# EAGLE design PCB (EAGLE 8.2.1)
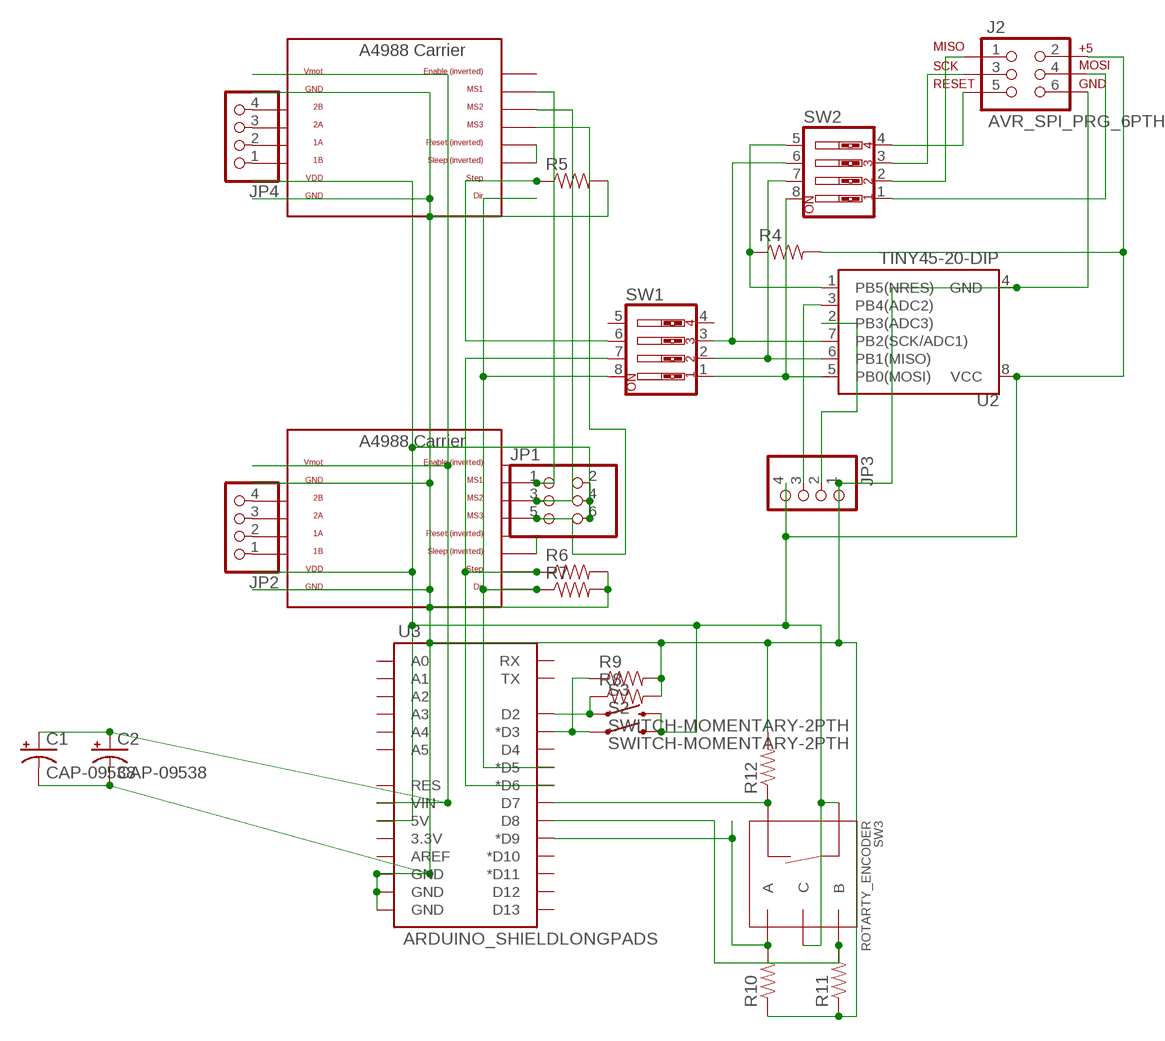
[diagram p0: schematic, sheet 1]

## Parts
C1  CAP-09538  1000UF-25V(PTH)  [CPOL-RADIAL-1000UF-25V]
C2  CAP-09538  1000UF-25V(PTH)  [CPOL-RADIAL-1000UF-25V]
J2  AVR_SPI_PRG_6PTH  [2X3]
JP1  PINHD-2X3  [2X03]
JP2  PINHD-1X4  [1X04]
JP3  PINHD-1X4  [1X04]
JP4  PINHD-1X4  [1X04]
R4  RESISTOR1206  [1206]
R5  RESISTOR1206  [1206]
R6  RESISTOR1206  [1206]
R7  RESISTOR1206  [1206]
R8  RESISTOR1206  [1206]
R9  RESISTOR1206  [1206]
R10  RESISTOR1206  [1206]
R11  RESISTOR1206  [1206]
R12  RESISTOR1206  [1206]
S2  SWITCH-MOMENTARY-2PTH  [TACTILE-PTH]
S3  SWITCH-MOMENTARY-2PTH  [TACTILE-PTH]
SW1  SW_DIP-4  [EDG-04]
SW2  SW_DIP-4  [EDG-04]
SW3  ROTARTY_ENCODER  [ROTARY_ENC_PLAIN]
U2  TINY45-20-DIP  ATTINY45TINY45-20-DIP  [DIP08]
U3  ARDUINO_SHIELDLONGPADS  [DUEMILANOVE_SHIELD_LONGPADS]
U$3  A4988BREAKOUT  [A4988BREAKOUT]
U$4  A4988BREAKOUT  [A4988BREAKOUT]

## Nets
N$19: JP1.1 U$3.MS1 U$4.MS1
N$20: JP1.3 U$3.MS2 U$4.MS2
N$21: JP1.5 U$3.MS3 U$4.MS3
N$22: JP2.1 U$3.1B
N$23: JP2.2 U$3.1A
N$24: JP2.3 U$3.2A
N$25: JP2.4 U$3.2B
N$26: R9.1 S2.1 U3.D3(*D3)
N$27: U$3.RST U$3.SLP(SLEEP)
N$28: R5.1 SW1.6 U$4.STEP
N$29: R6.1 SW1.7 U3.D6(*D6) U$3.STEP
N$30: R7.1 SW1.8 U3.D5(*D5) U$3.DIR U$4.DIR
N$31: R8.1 S3.1 U3.D2
N$32: JP3.3 U2.3(PB4(ADC2))
N$33: JP3.2 U2.2(PB3(ADC3))
N$34: JP4.1 U$4.1B
N$35: JP4.2 U$4.1A
N$36: JP4.3 U$4.2A
N$37: JP4.4 U$4.2B
N$38: R10.2 SW3.A U3.D9(*D9)
N$39: U$4.RST U$4.SLP(SLEEP)
N$41: C1.+ C2.+ U3.VIN U$3.VMOT U$4.VMOT
N$42: J2.2 JP1.2 JP1.4 JP1.6 JP3.4 R4.2 S2.3 S3.3 SW3.C SW3.SW+ U2.8(VCC) U3.5V U$3.VDD U$4.VDD
N$43: R11.2 SW3.B U3.D8
N$44: R12.1 SW3.SW- U3.D7
N$45: J2.4 SW2.1
N$46: J2.1 SW2.2
N$47: J2.3 SW2.3
N$48: J2.5 SW2.4
N$49: R4.1 SW2.5 U2.1(PB5(NRES))
N$50: SW1.3 SW2.6 U2.7(PB2(SCK/ADC1))
N$51: SW1.2 SW2.7 U2.6(PB1(MISO))
N$52: SW1.1 SW2.8 U2.5(PB0(MOSI))
N$54: C1.- C2.- J2.6 JP3.1 R5.2 R6.2 R7.2 R8.2 R9.2 R10.1 R11.1 R12.2 U2.4(GND) U3.GND@0(GND) U3.GND@1(GND) U3.GND@2(GND) U$3.GND U$3.GND@0(GND) U$4.GND U$4.GND@0(GND)
Unconnected: SW1.4 SW1.5 U3.3.3V U3.A0 U3.A1 U3.A2 U3.A3 U3.A4 U3.A5 U3.AREF U3.D4 U3.D10(*D10) U3.D11(*D11) U3.D12 U3.D13 U3.RES U3.RX U3.TX U$3.EN U$4.EN

## Library data of the parts
C1 C2 = SparkFun-Capacitors:1000UF-25V(PTH): CAP-08070; PROD_ID: CAP-09538
J2 = SparkFun-Connectors:AVR_SPI_PRG_6: AVR ISP 6 Pin This is the reduced ISP connector for AVR programming. Common on Arduino. This footprint will take up less PCB space and can be used with a 10-pin to 6-pin adapter such as SKU: BOB-08508 **Special note about "TEST_POINT" package. The stop mask is on the top side, so if you want your programming test points to be on the bottom of your board, make sure to place this package on the bottom side of the board. This also ensure that the orientation to program from the bottom side will be correct.
JP1 = pinhead:PINHD-2X3: PIN HEADER
JP2-JP4 = pinhead:PINHD-1X4: PIN HEADER
R4-R12 = SparkFun-Resistors:RESISTOR: Resistor Basic schematic elements and footprints for 0603, 1206, and PTH resistors.
S2 S3 = SparkFun-Electromechanical:SWITCH-MOMENTARY-2: Various NO switches- pushbuttons, reed, etc; PROD_ID: SWCH-08441
SW1 SW2 = special:SW_DIP-4: DIP SWITCH
SW3 = SparkFun-Electromechanical:ROTARTY_ENCODER: Simple no LED rotary encoder Example: COM-09117
U2 = SparkFun-DigitalIC:ATTINY45: Atmel 8-pin 2/4/8kB flash uC; PROD_ID: IC-09439
U3 = SparkFun-Boards:ARDUINO_SHIELD: Arduino shield footprint
U$3 U$4 = RepRapjr:A4988BREAKOUT

## Board
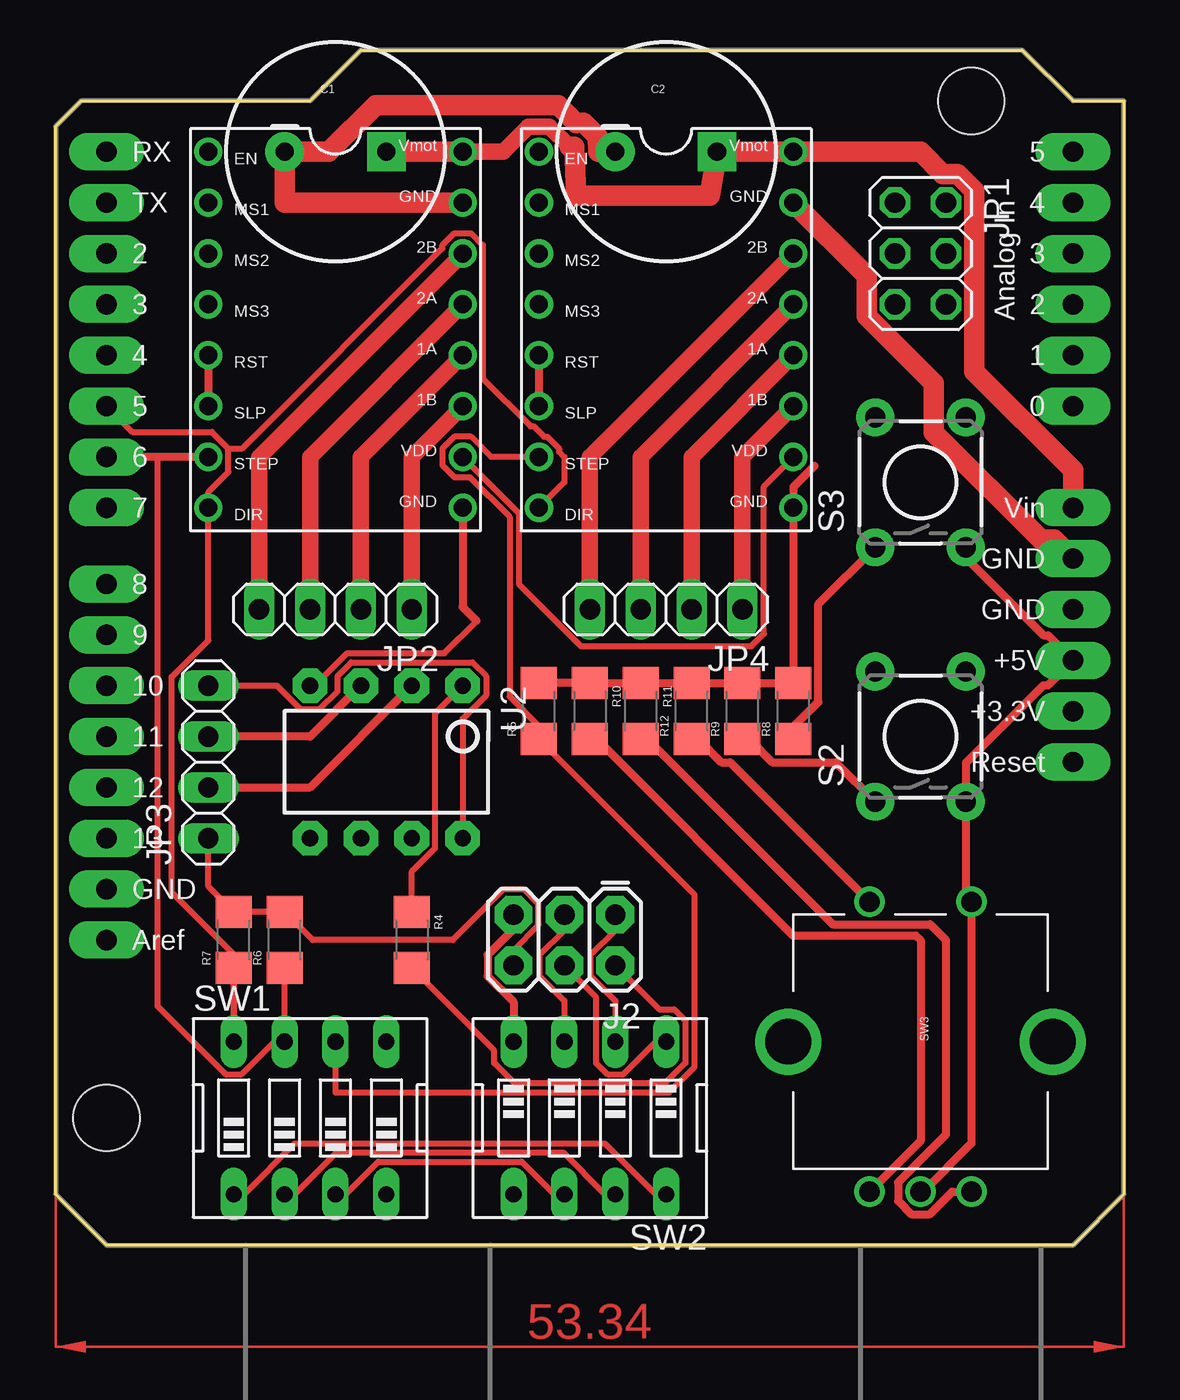
[diagram p1: board, top side]
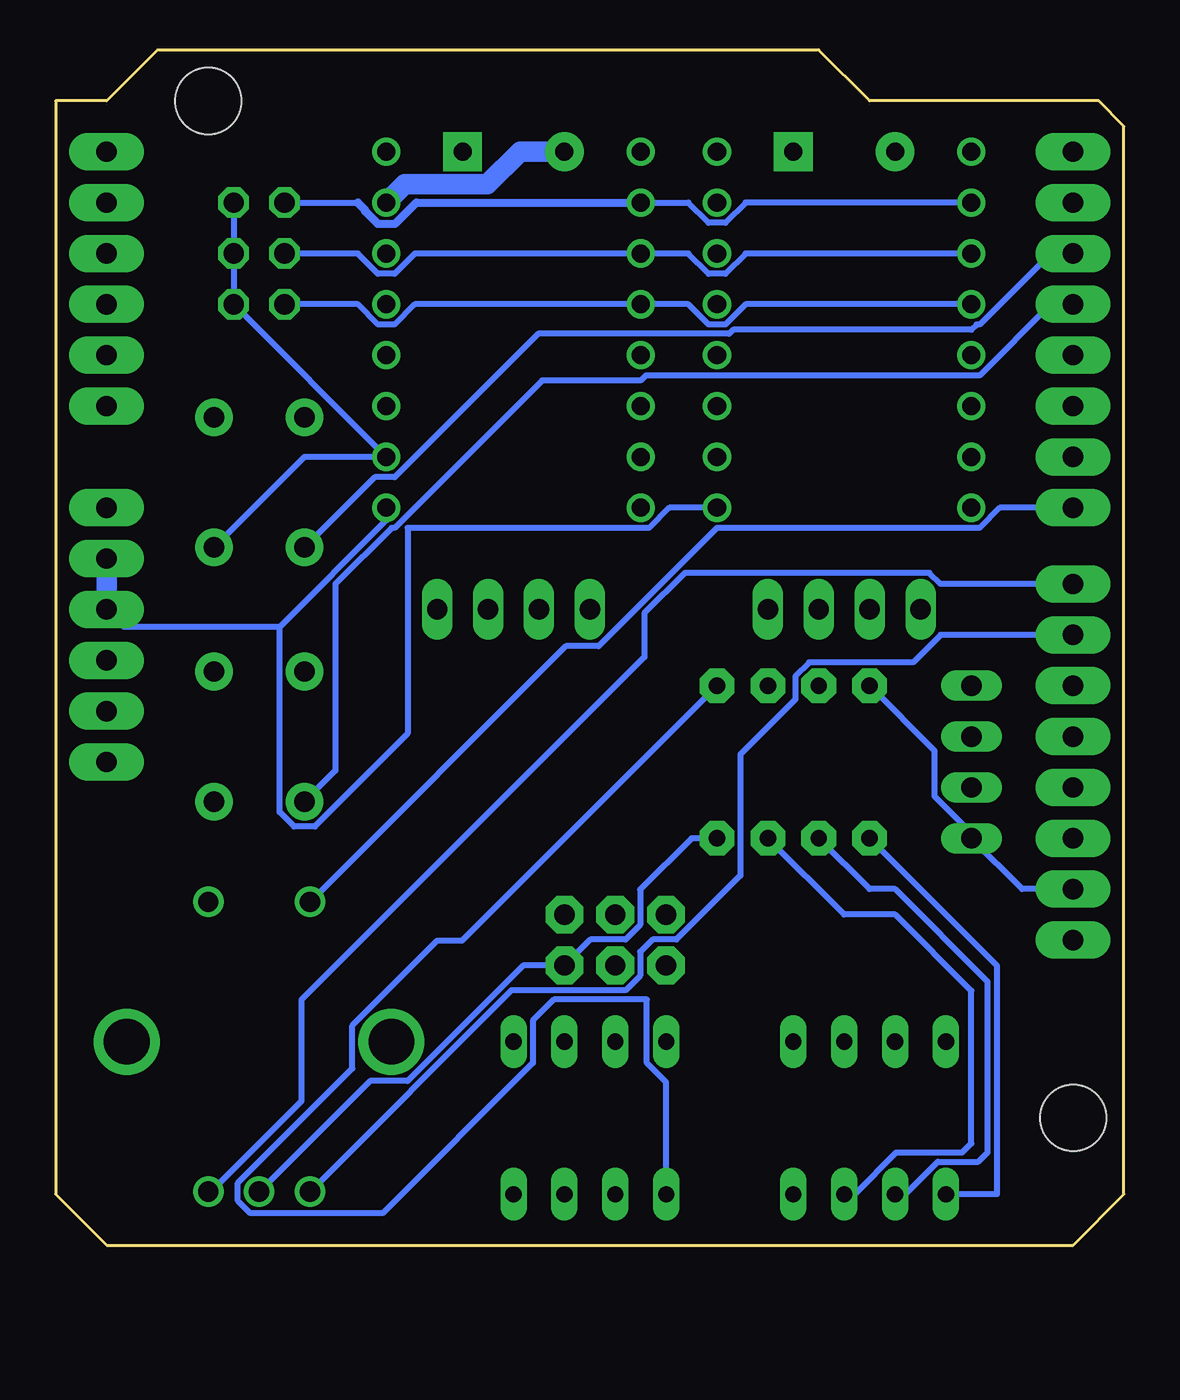
[diagram p2: board, bottom side, seen from below]

Size 53.34 x 59.69 mm. Coordinates in mm from the lower left corner, seen from the top.
Outline: 2.54,0 0,2.54 0,55.88 1.27,57.15 12.7,57.15 15.24,59.69 48.26,59.69 50.8,57.15 53.34,57.15 53.34,2.54 50.8,0 2.54,0
Copper layers (1*16): Top 0.035mm / dielectric 1.5mm / Bottom 0.035mm
Design rules "default": minimum track width 6mil, minimum drill 0.35mm, track to track 6mil, track to pad 6mil, pad to pad 6mil, via to via 6mil, smd to smd 6mil, copper to edge 40mil, drill to drill 6mil, minimum pad ring 10mil, minimum via ring 8mil, stop-mask expansion 4mil, vias tented up to drill 0mil, thermal gap 10mil

### Footprints (pad centres in the part's own frame; a part is rotated, then mirrored left to right if it is on the bottom)
CPOL-RADIAL-1000UF-25V = drill 0.9 pad 1.93 square: + 2.54,0 | drill 0.9 pad 1.93: - -2.54,0
2X3 = drill 1.016 pad 1.88 octagon: 1 0,0; 2 0,2.54; 3 2.54,0; 4 2.54,2.54; 5 5.08,0; 6 5.08,2.54
2X03 = drill 1.016 octagon: 1 -2.54,-1.27; 2 -2.54,1.27; 3 0,-1.27; 4 0,1.27; 5 2.54,-1.27; 6 2.54,1.27
1X04 = drill 1.016 long: 1 -3.81,0; 2 -1.27,0; 3 1.27,0; 4 3.81,0
1206 = smd 1.6 x 1.8: 1 -1.4,0; 2 1.4,0
TACTILE-PTH = drill 1.016 pad 1.88: 1 -3.251,2.261; 2 3.251,2.261; 3 -3.251,-2.261; 4 3.251,-2.261
EDG-04 = drill 0.813 long: 1 -3.81,-3.81; 2 -1.27,-3.81; 3 1.27,-3.81; 4 3.81,-3.81; 5 3.81,3.81; 6 1.27,3.81; 7 -1.27,3.81; 8 -3.81,3.81
ROTARY_ENC_PLAIN = drill 1.016: A 7.493,-2.54; B 7.493,2.54; C 7.493,0; SW+ -6.985,2.54; SW- -6.985,-2.54 | drill 2.286: P$3 0,6.604; P$4 0,-6.604
DIP08 = drill 0.813 pad 1.727 octagon: 1 -3.81,-3.81; 2 -1.27,-3.81; 3 1.27,-3.81; 4 3.81,-3.81; 5 3.81,3.81; 6 1.27,3.81; 7 -1.27,3.81; 8 -3.81,3.81
DUEMILANOVE_SHIELD_LONGPADS = drill 1.016 pad 1.88 long: 3.3V 50.8,26.67; 5V 50.8,29.21; A0 50.8,41.91; A1 50.8,44.45; A2 50.8,46.99; A3 50.8,49.53; A4 50.8,52.07; A5 50.8,54.61; AREF 2.54,15.24; D2 2.54,49.53; D3 2.54,46.99; D4 2.54,44.45; D5 2.54,41.91; D6 2.54,39.37; D7 2.54,36.83; D8 2.54,33.02; D9 2.54,30.48; D10 2.54,27.94; D11 2.54,25.4; D12 2.54,22.86; D13 2.54,20.32; GND@0 50.8,31.75; GND@1 50.8,34.29; GND@2 2.54,17.78; RES 50.8,24.13; RX 2.54,54.61; TX 2.54,52.07; VIN 50.8,36.83 | hole 3.302: 45.72,57.15; 2.54,6.35
A4988BREAKOUT = drill 0.9: 1A 8.89,1.27; 1B 11.43,1.27; 2A 6.35,1.27; 2B 3.81,1.27; DIR 16.51,-11.43; EN -1.27,-11.43; GND 16.51,1.27; GND@0 1.27,1.27; MS1 1.27,-11.43; MS2 3.81,-11.43; MS3 6.35,-11.43; RST 8.89,-11.43; SLP 11.43,-11.43; STEP 13.97,-11.43; VDD 13.97,1.27; VMOT -1.27,1.27

### Placement (x,y rotation side)
C1  13.97,54.61 0 top
C2  30.48,54.61 0 top
J2  27.94,16.51 180 top
JP1  43.18,49.53 270 top
JP2  13.97,31.75 180 top
JP3  7.62,24.13 90 top
JP4  30.48,31.75 180 top
R4  17.78,15.24 270 top
R5  24.13,26.67 90 top
R6  11.43,15.24 90 top
R7  8.89,15.24 90 top
R8  36.83,26.67 90 top
R9  34.29,26.67 90 top
R10  26.67,26.67 270 top
R11  29.21,26.67 270 top
R12  31.75,26.67 90 top
S2  43.18,25.4 90 top
S3  43.18,38.1 90 top
SW1  12.7,6.35 0 top
SW2  26.67,6.35 180 top
SW3  43.18,10.16 270 top
U2  16.51,24.13 180 top
U3  0,0 0 top
U$3  19.05,53.34 270 top
U$4  35.56,53.34 270 top

### Tracks (layer width: path | path; a pad name or v marks a point on that pad's centre or on a via)
N$19
  Bottom 0.305: U$3.MS1 18.89,52.07 19.9,51.06 20.74,51.06 21.75,52.07 U$4.MS1 | JP1.1 38.26,52.07
  Bottom 0.406: 38.26,52.07 37.89,51.7 37.89,51.63 37.27,51.01 36.39,51.01 35.33,52.07 U$4.MS1
N$20
  Bottom 0.305: U$3.MS2 18.89,49.53 19.9,48.52 20.74,48.52 21.75,49.53 U$4.MS2 35.4,49.53 36.41,48.52 37.25,48.52 38.26,49.53 JP1.3
N$21
  Bottom 0.305: U$3.MS3 18.89,46.99 19.9,45.98 20.74,45.98 21.75,46.99 U$4.MS3 35.4,46.99 36.41,45.98 37.25,45.98 38.26,46.99 JP1.5
N$22
  Top 0.813: JP2.1 17.78,39.37 U$3.1B
N$23
  Top 0.813: U$3.1A 15.24,39.37 JP2.2
N$24
  Top 0.813: U$3.2A 12.7,39.37 JP2.3
N$25
  Top 0.813: U$3.2B 10.16,39.37 JP2.4
N$26
  Top 0.406: R9.1 34.63,25.27 35.78,24.11 38.95,24.11 S2.1
  Bottom 0.305: U3.D3 3.65,46.99 7.2,43.44 23.87,43.44 24.13,43.18 29.05,43.18 36.41,35.82 36.57,35.82 39.37,33.02 39.37,23.7 S2.1
N$27
  Top 0.406: U$3.RST U$3.SLP
N$28
  Top 0.305: SW1.6 13.97,7.62 30.61,7.62 31.9,8.91 31.9,17.5 R5.1 | 24.13,25.4 R5.1 | 24.13,25.4 R5.1 | 24.13,25.4 24.13,25.94 22.66,27.41 22.66,36.38 20.68,38.36 19.9,38.36 19.31,38.95 19.31,39.79 19.9,40.38 20.74,40.38 21.75,39.37 U$4.STEP
N$29
  Top 0.305: R6.1 SW1.7 10.91,10.16 9.29,8.53 8.49,8.53 5.08,11.95 5.08,39.37
  Top 0.406: U$3.STEP 5.08,39.37 U3.D6
N$30
  Top 0.305: U3.D5 3.83,40.62 7.8,40.62 8.63,39.79 | 8.63,39.79 8.63,38.62 7.62,37.61 U$3.DIR 7.62,30.21 5.79,28.38 5.79,17.61 8.89,14.51 SW1.8 R7.1 8.89,13.97 | 8.63,39.79 9.31,39.79 19.31,49.79 19.31,49.95 19.9,50.54 20.74,50.54 21.33,49.95 21.33,43.28 23.71,40.9 23.87,40.9 24.39,40.38 24.55,40.38 25.14,39.79 25.14,39.63 25.4,39.37 25.4,38.1 U$4.DIR
N$31
  Top 0.406: R8.1 36.83,25.87 38.09,27.12 38.09,32.02 S3.1
  Bottom 0.305: U3.D2 3.65,49.53 7.2,45.98 7.36,45.98 7.62,45.72 19.52,45.72 19.71,45.52 29.25,45.52 36.41,38.36 37.41,38.36 S3.1
N$32
  Top 0.406: U2.3 12.7,25.4 JP3.3
N$33
  Top 0.406: JP3.2 12.7,22.86 U2.2
N$34
  Top 0.813: U$4.1B 34.29,39.37 JP4.1
N$35
  Top 0.813: JP4.2 31.75,39.37 U$4.1A
N$36
  Top 0.813: U$4.2A 29.21,39.37 JP4.3
N$37
  Top 0.813: JP4.4 26.67,39.37 U$4.2B
N$38
  Top 0.406: R10.2 27.01,25.27 36.81,15.47 42.95,15.47 43.18,15.24 43.18,5.21 SW3.A
  Bottom 0.305: U3.D9 9.16,30.48 10.53,29.11 15.72,29.11 16.41,28.42 16.41,27.26 19.15,24.52 19.15,18.46 22.34,15.27 23.54,15.27 24.16,14.65 24.16,13.45 24.88,12.72 30.58,12.72 SW3.A
N$39
  Top 0.406: U$4.RST U$4.SLP
N$41
  Top 0.813: U$3.VMOT 22.34,54.61 23.61,55.87 24.65,55.87 25.66,54.87 25.92,54.61
  Top 1.016: U3.VIN 50.8,38.71 45.87,43.63 45.87,52.66 45.04,53.49 44.3,53.49 43.18,54.61 U$4.VMOT C2.+ 32.66,52.43 26,52.43 25.9,54.87 25.66,54.87 | C1.+ U$3.VMOT
N$42
  Top 0.305: J2.2 30.12,11.79 30.88,11.79 31.45,11.22 31.45,9.1 30.42,8.08 22.92,8.08 21.89,9.1 21.89,9.72 R4.2 | JP3.4 11.05,27.94 12.22,26.77 13.18,26.77 14.07,27.66 14.07,28.42 14.76,29.11 20.8,29.11 21.49,28.42 21.49,27.46 20.32,26.29 U2.8 | U$3.VDD 23.12,36.57 23.12,33.03 26.23,29.92 34.73,29.92 35.36,30.55 35.36,37.9 U$4.VDD
  Top 0.406: S3.3 45.44,34.34 49.32,30.45 49.55,30.45 U3.5V 49.55,27.96 49.32,27.96 45.44,24.08 S2.3 45.44,17.42 SW3.SW+ 45.72,5.08 43.18,2.54 SW3.C
  Bottom 0.305: JP1.2 JP1.4 JP1.6 U$4.VDD 40.92,39.37 S3.3 | U2.8 21.59,20.32 24.16,17.75 24.16,15.99 24.88,15.27 26.64,15.27 J2.2 30,13.97 35.77,8.2 37.64,8.2 SW3.C
N$43
  Top 0.406: R11.2 29.55,25.27 38.79,16.03 43.66,16.03 44.45,15.24 44.45,5.52 42.06,3.13 42.06,2.2 42.72,1.55 43.64,1.55 44.76,2.67 SW3.B
  Bottom 0.305: U3.D8 9.16,33.02 9.72,33.58 21.92,33.58 23.94,31.56 23.94,29.37 41.07,12.24 41.07,7.19 45.72,2.54 SW3.B
N$44
  Top 0.406: SW3.SW- 33.67,24.11 33.24,24.11 32.09,25.27 R12.1
  Bottom 0.305: U3.D7 6.19,36.83 7.2,35.82 20.33,35.82 26.23,29.92 27.86,29.92 SW3.SW-
N$45
  Top 0.305: J2.4 26.98,12.39 26.98,9.1 27.54,8.53 28.34,8.53 29.96,10.16 SW2.1
N$46
  Top 0.305: J2.1 27.94,15.73 26.7,14.49 26.7,13.45 27.94,12.21 SW2.2
N$47
  Top 0.305: J2.3 25.4,15.73 24.16,14.49 24.16,13.45 25.4,12.21 SW2.3
N$48
  Top 0.406: J2.5 22.86,15.8 21.57,14.51 21.57,13.43 22.86,12.14 SW2.4
N$49
  Top 0.305: R4.1 17.78,18.67 18.95,19.84 18.95,26.57 U2.1
  Bottom 0.305: SW2.5 22.86,8.13 23.82,9.1 23.82,12.27 28.47,12.27 29.52,11.22 29.52,9.1 37.01,1.6 43.62,1.6 44.25,2.23 44.25,3.11 38.53,8.82 38.53,10.97 34.29,15.21 33.05,15.21 U2.1
N$50
  Top 0.305: SW1.3 14.48,2.54 16.11,4.17 23.26,4.17 24.89,2.54 SW2.6
  Bottom 0.305: SW1.3 13.46,2.54 11.37,4.62 8.08,4.62 7.62,5.08 7.62,12.7 11.43,16.51 13.97,16.51 U2.7
N$51
  Top 0.305: SW1.2 11.95,2.54 14.03,4.62 25.34,4.62 27.43,2.54 SW2.7
  Bottom 0.305: SW1.2 10.91,2.54 9.29,4.17 7.26,4.17 6.81,4.62 6.81,13.16 11.43,17.78 12.7,17.78 U2.6
N$52
  Top 0.305: SW1.1 9.4,2.54 11.95,5.08 27.43,5.08 29.96,2.54 SW2.8
  Bottom 0.305: U2.5 6.35,13.97 6.35,2.54 SW1.1
N$54
  Top 0.305: JP3.1 7.62,17.91 R7.2 R6.2 12.83,15.24 19.83,15.24 22.34,17.75 23.38,17.75 24.11,17.03 24.11,15.99 22.86,14.75 J2.6 | 21.02,31.18 19.41,29.57 14.57,29.57 12.94,27.94 U2.4
  Top 0.406: U$3.GND 20.32,31.88 21.02,31.18 | R5.2 R10.1 R11.1 R12.2 R9.2 R8.2 U$4.GND 36.83,37.87 37.89,38.93
  Top 1.016: U3.GND@1 49.86,35.23 49.2,35.23 43.84,40.59 43.84,43.05 40.49,46.4 40.49,48.41 U$4.GND@0 | U$3.GND@0 11.43,52.07 C1.- 13.65,54.61 15.97,56.94 25.09,56.94 25.99,56.04 26.34,56.05 26.36,56.04 26.38,56.04 26.71,55.71 27.05,55.4 27.05,55.37 27.07,55.35 27.1,54.61 C2.-
  Bottom 0.305: U3.GND@2 5.08,17.78 JP3.1 7.62,20.59 9.45,22.42 9.45,24.69 U2.4 | U$3.GND 22.7,36.83 23.71,35.82 35.77,35.82 35.77,25.54 40.4,20.9 41.44,20.9 42.16,21.63 42.16,30.87 | U$4.GND 36.83,36.21 42.16,30.87 | 42.16,30.87 49.92,30.87 U3.GND@0
  Bottom 1.016: U3.GND@0 U3.GND@1 | C2.- 30.16,54.61 31.78,52.98 35.92,52.98 U$4.GND@0
(copper drawn outside any net)
  shapes: Top area x3